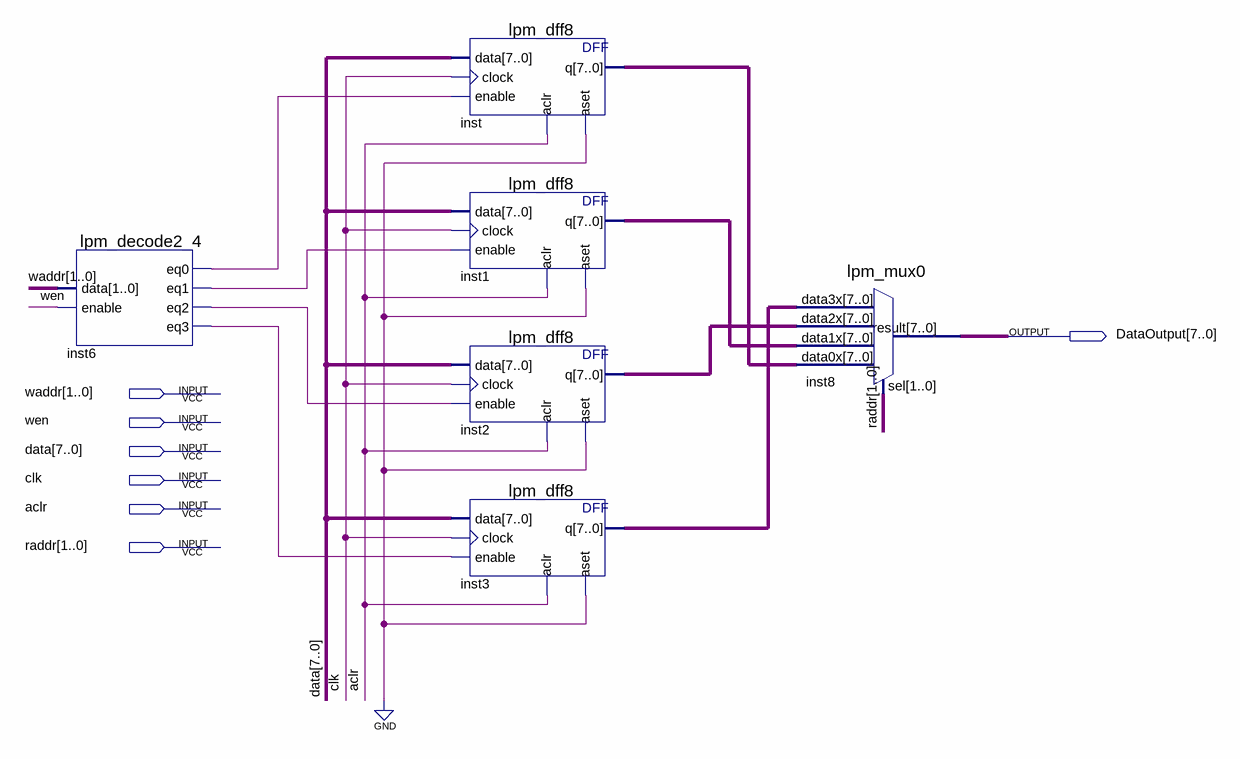
[diagram p0: schematic sheet]
// Quartus schematic reg_group.bdf as structural Verilog: 6 symbols, 7 pins
module reg_group (
  input  [1:0] waddr,
  input  wen,
  input  [7:0] data,
  input  clk,
  input  aclr,
  input  [1:0] raddr,
  output [7:0] DataOutput
);

  wire inst6_eq0, inst6_eq1, inst6_eq2, inst6_eq3;
  wire [7:0] inst1_q, inst2_q, inst3_q, inst_q;

  lpm_decode2_4 inst6 (.data(waddr), .enable(wen), .eq0(inst6_eq0), .eq1(inst6_eq1), .eq2(inst6_eq2), .eq3(inst6_eq3));
  lpm_dff8 inst (.data(data), .clock(clk), .enable(inst6_eq0), .aclr(aclr), .aset(1'b0), .q(inst_q));
  lpm_dff8 inst1 (.data(data), .clock(clk), .enable(inst6_eq1), .aclr(aclr), .aset(1'b0), .q(inst1_q));
  lpm_dff8 inst2 (.data(data), .clock(clk), .enable(inst6_eq2), .aclr(aclr), .aset(1'b0), .q(inst2_q));
  lpm_dff8 inst3 (.data(data), .clock(clk), .enable(inst6_eq3), .aclr(aclr), .aset(1'b0), .q(inst3_q));
  lpm_mux0 inst8 (
    .data3x(inst3_q), .data2x(inst2_q), .data1x(inst1_q), .data0x(inst_q), .sel(raddr), .result(DataOutput));
endmodule
